# Altium schematic sheet USB_UART.SchDoc
size A4
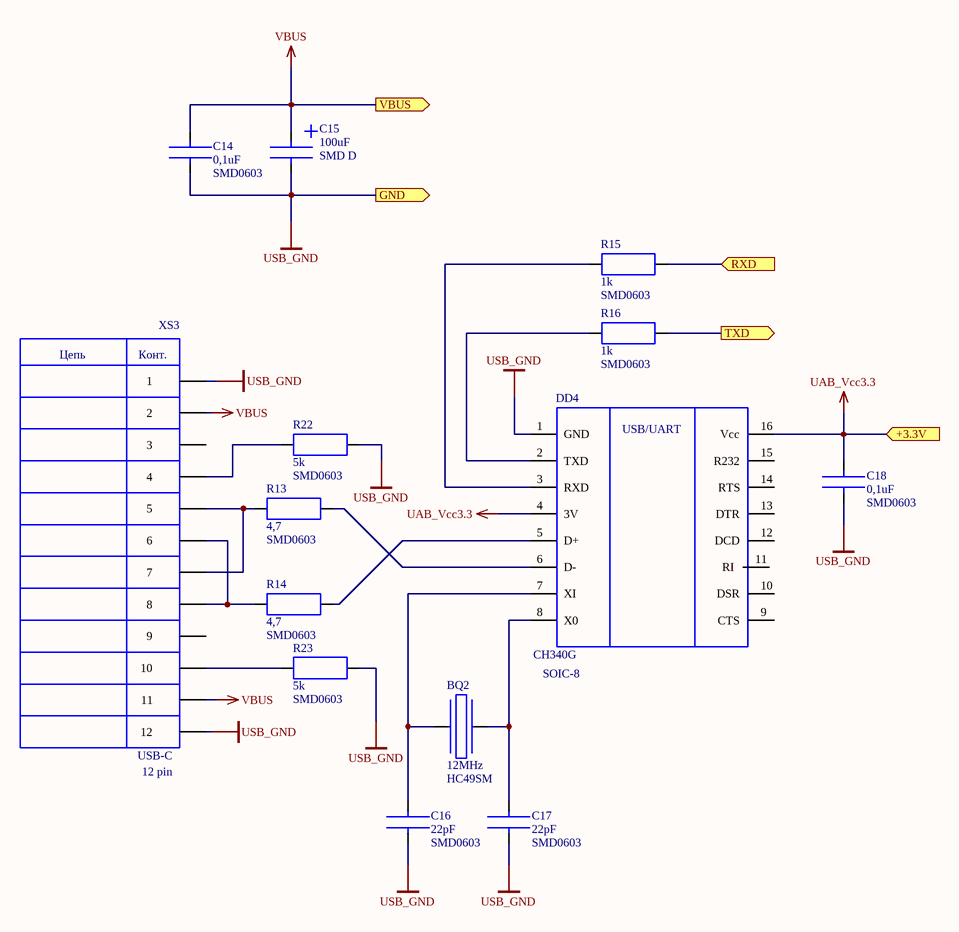
[diagram p0: USB_UART.SchDoc]

## Parts
BQ2  12МHz  Package: HC49SM  [BQ_HC49SM]
C14  0,1uF  Package: SMD0603  [SMD0603(1005)]
C15  100uF  Package: SMD D  [TANT_CAP_D(7343)]
C16  22pF  Package: SMD0603  [SMD0603(1005)]
C17  22pF  Package: SMD0603  [SMD0603(1005)]
C18  0,1uF  Package: SMD0603  [SMD0603(1005)]
DD4  CH340G  Package: SOIC-8  [SOIC16]
R13  4,7  Package: SMD0603  [SMD0603(1005)]
R14  4,7  Package: SMD0603  [SMD0603(1005)]
R15  1k  Package: SMD0603  [SMD0603(1005)]
R16  1k  Package: SMD0603  [SMD0603(1005)]
R22  5k  Package: SMD0603  [SMD0603(1005)]
R23  5k  Package: SMD0603  [SMD0603(1005)]
XS3  USB-C  Package: 12 pin  [USB_C]

## Ports
+3.3V (in), GND (out), RXD (in), TXD (out), VBUS (out)

## Nets
UAB_Vcc3.3: C18.2 DD4.4(3V) DD4.16(Vcc) ; port +3.3V
USB_GND: C14.1 C15.2 C16.1 C17.1 C18.1 DD4.1(GND) R22.1 R23.1 XS3.1 XS3.12 ; port GND
VBUS: C14.2 C15.1 XS3.2 XS3.11 ; port VBUS
RXD: R15.1 ; port RXD
TXD: R16.1 ; port TXD
NetBQ2_1: BQ2.1 C16.2 DD4.7(XI)
NetBQ2_2: BQ2.2 C17.2 DD4.8(X0)
NetDD4_2: DD4.2(TXD) R16.2
NetDD4_3: DD4.3(RXD) R15.2
NetDD4_5: DD4.5(D+) R14.2
NetDD4_6: DD4.6(D-) R13.2
NetR13_1: R13.1 XS3.5 XS3.7
NetR14_1: R14.1 XS3.6 XS3.8
NetR22_2: R22.2 XS3.4
NetR23_2: R23.2 XS3.10

Not connected (* = marked no-connect by the designer): DD4 9(CTS) 10(DSR) 11(RI) 12(DCD) 13(DTR) 14(RTS) 15(R232); XS3 3 9

## Notes on the sheet
- (in symbol USB_C) Цепь; Конт.
- (in symbol Микросхема CH340G) USB/UART

## Library data of the parts
BQ2 = BQ_HC49SM: ValueBOM: Кварцевый резонатор 12МГц HC49S; Type: BQ; Value: 12МHz
C14 C18 = CER_CUP_0603: Type: C; ValueBOM: Конденсатор керамический 0,1мкФ SMD 0603 1%; Value: 0,1uF
C15 = C_TANT_D: Type: C; ValueBOM: Конденсатор танталовый 100мкФ х 16В 10%  SMD D; Value: 100uF
C16 C17 = CER_CUP_0603: Type: C; ValueBOM: Конденсатор керамический 22пФ SMD 0603 1%; Value: 22pF
DD4 = Микросхема CH340G: Type: DD; Value: CH340G; ValueBOM: Микросхема CH340G
R13 R14 = R_0603: ValueBOM: Резистор 4,7Ом SMD 0603 1%; Type: R; Value: 4,7
R15 R16 = R_0603: ValueBOM: Резистор 1кОм SMD 0603 1%; Type: R; Value: 1k
R22 R23 = R_0603: ValueBOM: Резистор 5кОм SMD 0603 1%; Type: R; Value: 5k
XS3 = USB_C: ValueBOM: Разъём USB type C 12 контактный; Value: USB-C; Type: XS; Link: https://www.voltmaster-samara.ru/upload/iblock/68a/68a6841d20080b30588d6f36d0bc1a38.pdf